# Altium schematic sheet SchLight.SchDoc
size A3; PageSetup: Record=PageOptions|CenterHorizontal=True|CenterVertical=True|PrintScale=0.70|XCorrection=1.00|YCorrection=1.00|PrintKind=0|BorderSize=5000000|LeftOffset=0|BottomOffset=0|Orientation=2|PaperLength=1000|PaperWidth=1000|Scale=100|PaperSource=7|PrintQuality=-4|MediaType=1|DitherType=10|PaperKind=Letter|PrintScaleMode=1
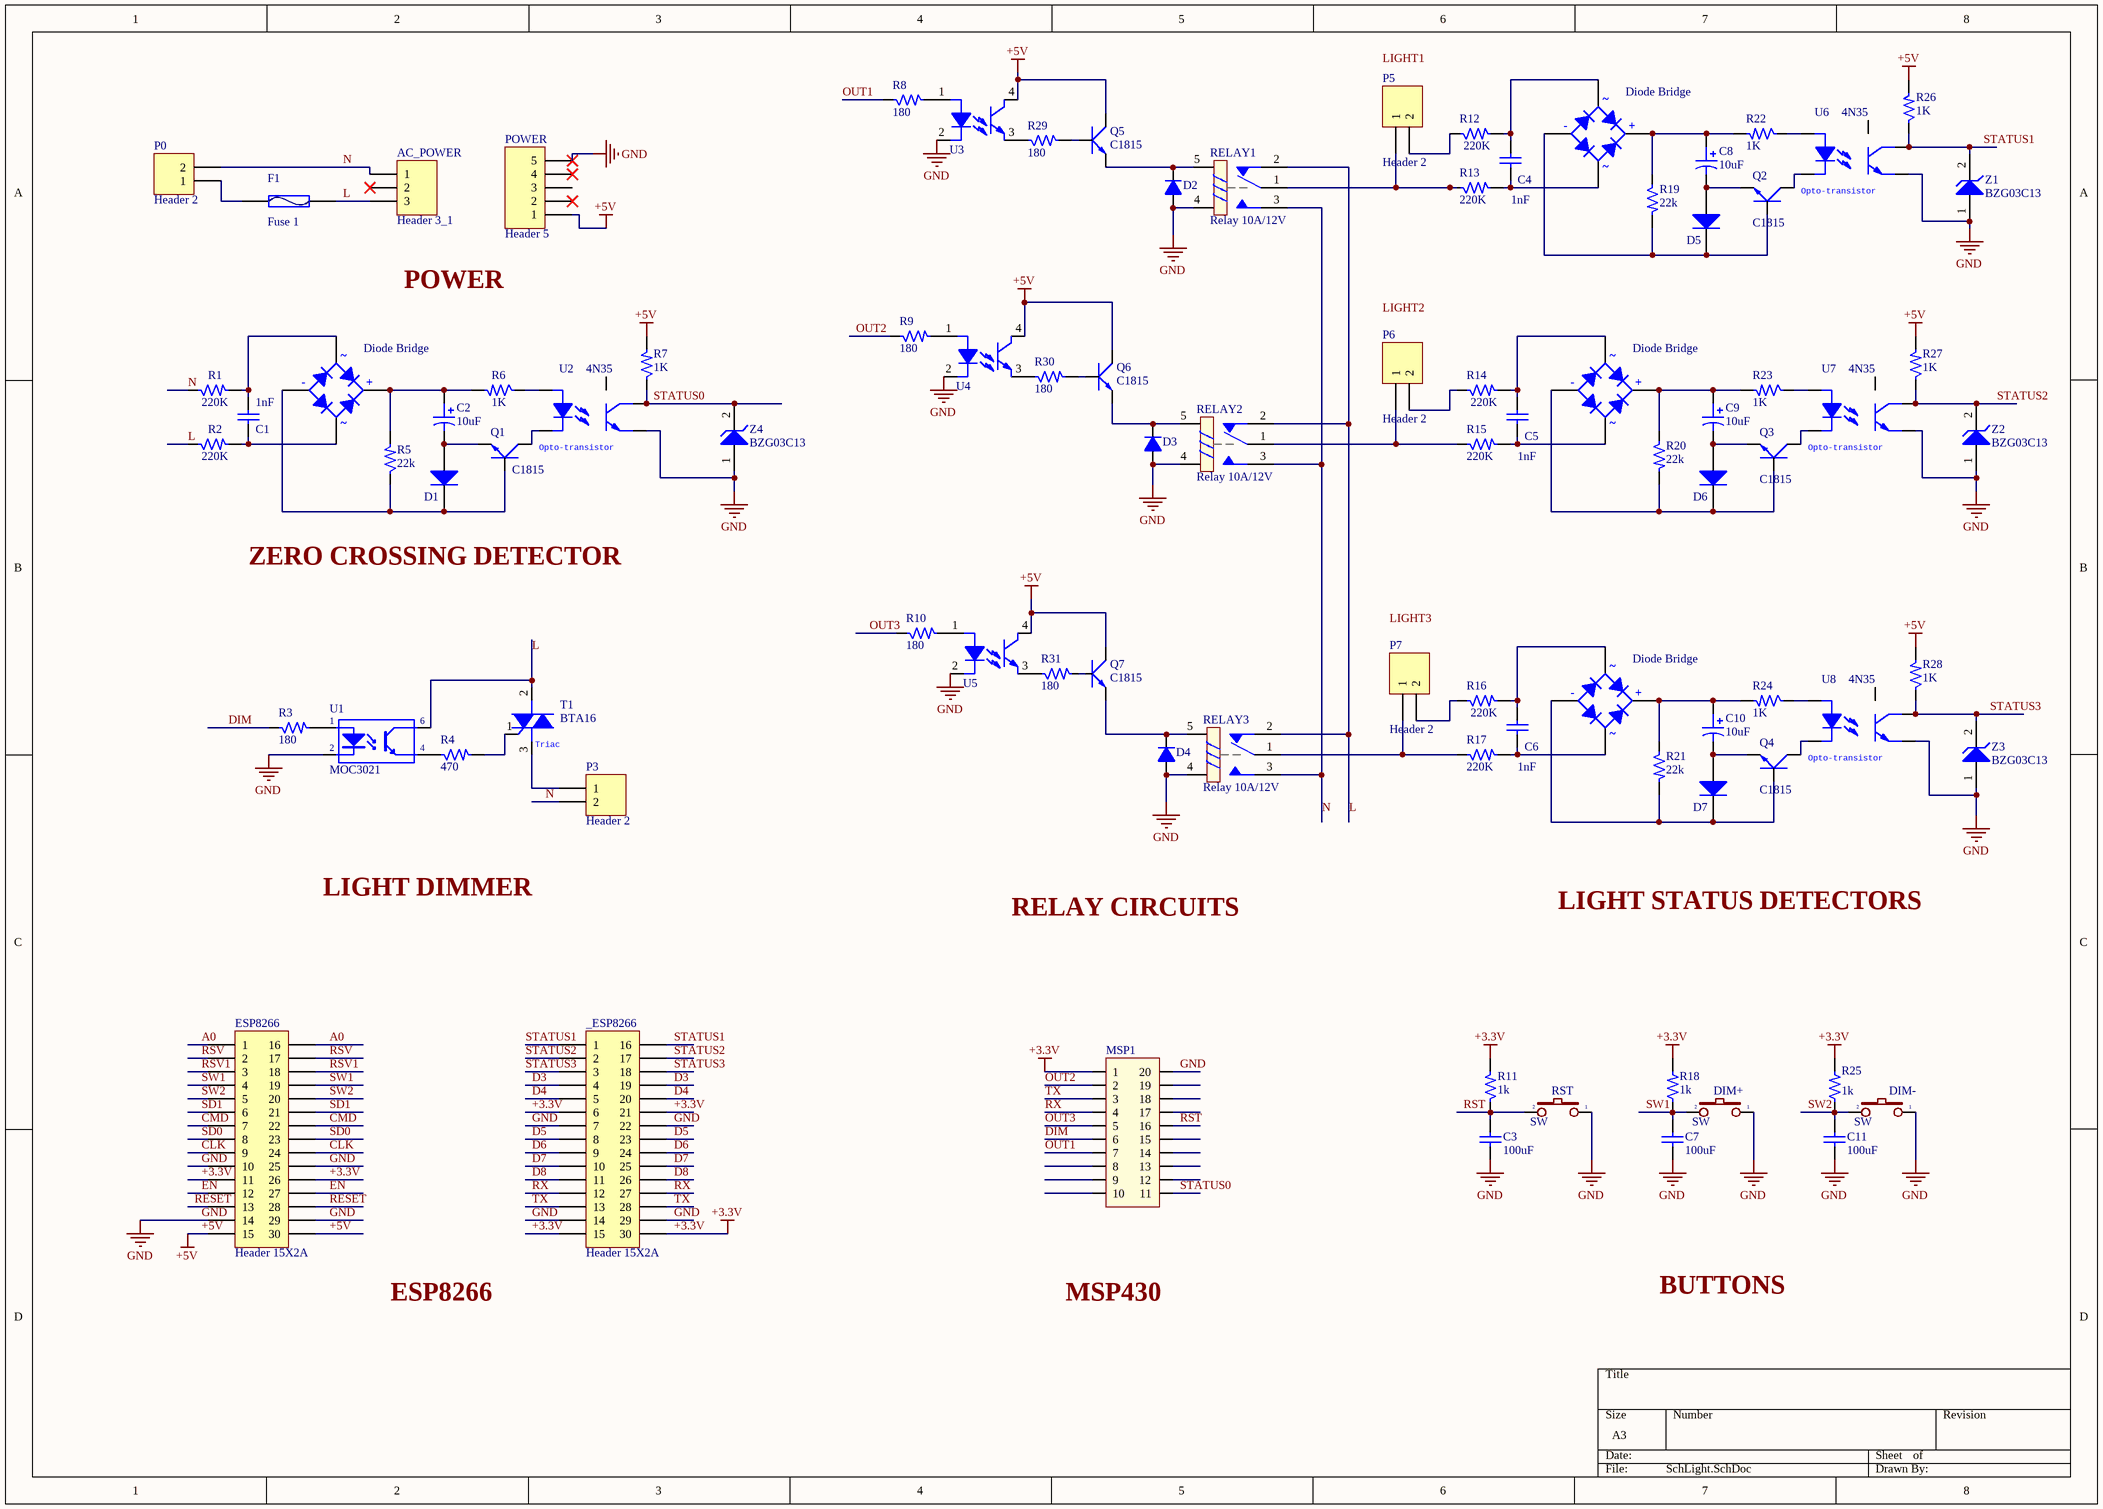
[diagram p0: SchLight.SchDoc]

## Parts
1  Diode Bridge  [DIODE BRIDGE (1A)]
3  Diode Bridge  [DIODE BRIDGE (1A)]
4  Diode Bridge  [DIODE BRIDGE (1A)]
?  Diode Bridge  [DIODE BRIDGE (1A)]
_ESP8266  Header 15X2A  [HDR2X15_CEN]
AC_POWER  Header 3_1  [HDR1X3]
C1  value 1nF  [C-NP-0805]  (hidden comment: Cap Non-pol)
C2  value 10uF  [C-P-0805]  (hidden comment: Cap Pol)
C3  value 100uF  [C-NP-0805]  (hidden comment: Cap Non-pol)
C4  value 1nF  [C-NP-0805]  (hidden comment: Cap Non-pol)
C5  value 1nF  [C-NP-0805]  (hidden comment: Cap Non-pol)
C6  value 1nF  [C-NP-0805]  (hidden comment: Cap Non-pol)
C7  value 100uF  [C-NP-0805]  (hidden comment: Cap Non-pol)
C8  value 10uF  [C-P-0805]  (hidden comment: Cap Pol)
C9  value 10uF  [C-P-0805]  (hidden comment: Cap Pol)
C10  value 10uF  [C-P-0805]  (hidden comment: Cap Pol)
C11  value 100uF  [C-NP-0805]  (hidden comment: Cap Non-pol)
D1  Diode 1N4148  [SOD80]  (value not drawn)
D2  Diode  [SOD80]  (value not drawn)
D3  Diode  [SOD80]  (value not drawn)
D4  Diode  [SOD80]  (value not drawn)
D5  Diode 1N4148  [SOD80]  (value not drawn)
D6  Diode 1N4148  [SOD80]  (value not drawn)
D7  Diode 1N4148  [SOD80]  (value not drawn)
DIM+  SW  [SW4]
DIM-  SW  [SW4]
ESP8266  Header 15X2A  [HDR2X15_CEN]
F1  Fuse 1  [Fuse]
MSP1  Zip 20  [DIP20/W0.3]  (value not drawn)
P0  Header 2  [TBlock 2]
P3  Header 2  [TBlock 2]
P5  Header 2  [TBlock 2]
P6  Header 2  [TBlock 2]
P7  Header 2  [TBlock 2]
POWER  Header 5  [Header 5]
Q1  C1815  [SOT23B]
Q2  C1815  [SOT23B]
Q3  C1815  [SOT23B]
Q4  C1815  [SOT23B]
Q5  C1815  [SOT23B]
Q6  C1815  [SOT23B]
Q7  C1815  [SOT23B]
R1  220K  [SM-1206]
R2  220K  [SM-1206]
R3  180  [SM-1206]
R4  470  [SM-1206]
R5  22k  [SM-1206]
R6  1K  [SM-1206]
R7  1K  [SM-1206]
R8  180  [SM-1206]
R9  180  [SM-1206]
R10  180  [SM-1206]
R11  1k  [SM-1206]
R12  220K  [SM-1206]
R13  220K  [SM-1206]
R14  220K  [SM-1206]
R15  220K  [SM-1206]
R16  220K  [SM-1206]
R17  220K  [SM-1206]
R18  1k  [SM-1206]
R19  22k  [SM-1206]
R20  22k  [SM-1206]
R21  22k  [SM-1206]
R22  1K  [SM-1206]
R23  1K  [SM-1206]
R24  1K  [SM-1206]
R25  1k  [SM-1206]
R26  1K  [SM-1206]
R27  1K  [SM-1206]
R28  1K  [SM-1206]
R29  180  [SM-1206]
R30  180  [SM-1206]
R31  180  [SM-1206]
RELAY1  Relay 10A/12V  [RL_SPDT_10A]
RELAY2  Relay 10A/12V  [RL_SPDT_10A]
RELAY3  Relay 10A/12V  [RL_SPDT_10A]
RST  SW  [SW4]
T1  BTA16  [TO-220]
U1  MOC3021  [DIP6/W0.3]
U2  4N35  [DIP6]
U3  PC817  [DIP4]  (value not drawn)
U4  PC817  [DIP4]  (value not drawn)
U5  PC817  [DIP4]  (value not drawn)
U6  4N35  [DIP6]
U7  4N35  [DIP6]
U8  4N35  [DIP6]
Z1  BZG03C13  [SMD Capacistor 1206]
Z2  BZG03C13  [SMD Capacistor 1206]
Z3  BZG03C13  [SMD Capacistor 1206]
Z4  BZG03C13  [SMD Capacistor 1206]

## Nets
+3.3V: _ESP8266.6 _ESP8266.15 _ESP8266.21 _ESP8266.30 ESP8266.11 ESP8266.26 MSP1.1 R11.2 R18.2 R25.2
+5V: ESP8266.15 ESP8266.30 POWER.1 Q5.2(C) Q6.2(C) Q7.2(C) R7.2 R26.2 R27.2 R28.2 U3.4 U4.4 U5.4
GND: _ESP8266.7 _ESP8266.14 _ESP8266.22 _ESP8266.29 C3.1 C7.1 C11.1 D2.1(A) D3.1(A) D4.1(A) DIM+.1 DIM-.1 ESP8266.10 ESP8266.14 ESP8266.25 ESP8266.29 MSP1.20 POWER.5 RELAY1.4 RELAY2.4 RELAY3.4 RST.1 U1.2(K) U2.4 U3.2 U4.2 U5.2 U6.4 U7.4 U8.4 Z1.1(A) Z2.1(A) Z3.1(A) Z4.1(A)
A0: ESP8266.1 ESP8266.16
CLK: ESP8266.9 ESP8266.24
CMD: ESP8266.7 ESP8266.22
D3: _ESP8266.4 _ESP8266.19
D4: _ESP8266.5 _ESP8266.20
D5: _ESP8266.8 _ESP8266.23
D6: _ESP8266.9 _ESP8266.24
D7: _ESP8266.10 _ESP8266.25
D8: _ESP8266.11 _ESP8266.26
DIM: MSP1.6 R3.1
EN: ESP8266.12 ESP8266.27
L: AC_POWER.3 F1.2 R2.1 RELAY1.2 RELAY2.2 RELAY3.2 T1.2(A1) U1.6(C)
N: AC_POWER.1 P0.2 P3.2 R1.1 RELAY1.3 RELAY2.3 RELAY3.3
OUT1: MSP1.7 R8.1
OUT2: MSP1.2 R9.1
OUT3: MSP1.5 R10.1
RESET: ESP8266.13 ESP8266.28
RST: C3.2 MSP1.16 R11.1 RST.2
RSV: ESP8266.2 ESP8266.17
RSV1: ESP8266.3 ESP8266.18
RX: _ESP8266.12 _ESP8266.27 MSP1.4
SD0: ESP8266.8 ESP8266.23
SD1: ESP8266.6 ESP8266.21
STATUS0: MSP1.11 R7.1 U2.5 Z4.2(K)
STATUS1: _ESP8266.1 _ESP8266.16 R26.1 U6.5 Z1.2(K)
STATUS2: _ESP8266.2 _ESP8266.17 R27.1 U7.5 Z2.2(K)
STATUS3: _ESP8266.3 _ESP8266.18 R28.1 U8.5 Z3.2(K)
SW1: C7.2 DIM+.2 ESP8266.4 ESP8266.19 R18.1
SW2: C11.2 DIM-.2 ESP8266.5 ESP8266.20 R25.1
TX: _ESP8266.13 _ESP8266.28 MSP1.3
Net1_1: 1.1(K) C2.1 R5.2 R6.2
Net1_2: 1.2(C) C1.2 R1.2
Net1_3: 1.3(C) C1.1 R2.2
Net1_4: 1.4(A) D1.2(K) Q1.3(B) R5.1
Net3_1: 3.1(K) C9.1 R20.1 R23.2
Net3_2: 3.2(C) C5.2 R14.2
Net3_3: 3.3(C) C5.1 R15.2
Net3_4: 3.4(A) D6.2(K) Q3.3(B) R20.2
Net4_1: 4.1(K) C10.1 R21.1 R24.2
Net4_2: 4.2(C) C6.2 R16.2
Net4_3: 4.3(C) C6.1 R17.2
Net4_4: 4.4(A) D7.2(K) Q4.3(B) R21.2
Net?_1: ?.1(K) C8.1 R19.1 R22.2
Net?_2: ?.2(C) C4.2 R12.2
Net?_3: ?.3(C) C4.1 R13.2
Net?_4: ?.4(A) D5.2(K) Q2.3(B) R19.2
NetC2_2: C2.2 D1.1(A) Q1.1(E)
NetC8_2: C8.2 D5.1(A) Q2.1(E)
NetC9_2: C9.2 D6.1(A) Q3.1(E)
NetC10_2: C10.2 D7.1(A) Q4.1(E)
NetD2_2: D2.2(K) Q5.1(E) RELAY1.5
NetD3_2: D3.2(K) Q6.1(E) RELAY2.5
NetD4_2: D4.2(K) Q7.1(E) RELAY3.5
NetF1_1: F1.1 P0.1
NetP3_1: P3.1 T1.3(A2)
NetP5_1: P5.1 R13.1 RELAY1.1
NetP5_2: P5.2 R12.1
NetP6_1: P6.1 R15.1 RELAY2.1
NetP6_2: P6.2 R14.1
NetP7_1: P7.1 R17.1 RELAY3.1
NetP7_2: P7.2 R16.1
NetQ1_2: Q1.2(C) U2.2
NetQ2_2: Q2.2(C) U6.2
NetQ3_2: Q3.2(C) U7.2
NetQ4_2: Q4.2(C) U8.2
NetQ5_3: Q5.3(B) R29.2
NetQ6_3: Q6.3(B) R30.2
NetQ7_3: Q7.3(B) R31.2
NetR3_2: R3.2 U1.1(A)
NetR4_1: R4.1 U1.4(E)
NetR4_2: R4.2 T1.1(G)
NetR6_1: R6.1 U2.1
NetR8_2: R8.2 U3.1
NetR9_2: R9.2 U4.1
NetR10_2: R10.2 U5.1
NetR22_1: R22.1 U6.1
NetR23_1: R23.1 U7.1
NetR24_1: R24.1 U8.1
NetR29_1: R29.1 U3.3
NetR30_1: R30.1 U4.3
NetR31_1: R31.1 U5.3

Not connected (* = marked no-connect by the designer): AC_POWER 2*; MSP1 8 9 10 12 13 14 15 17 18 19; POWER 2* 3 4*; U2 6; U6 6; U7 6; U8 6

## Notes on the sheet
- POWER
- ZERO CROSSING DETECTOR
- LIGHT DIMMER
- RELAY CIRCUITS
- LIGHT STATUS DETECTORS
- ESP8266
- MSP430
- BUTTONS
- Labels drawn without touching a wire or pin: LIGHT1, LIGHT2, LIGHT3
- (in symbol 4N35) Opto-transistor
- (in symbol Diode Bridge) ~; -; +

## Library data of the parts
1 3 4 ? = Diode Bridge: Full Wave Diode Bridge; Published: 8-Jun-2000; LatestRevisionDate: 17-Jul-2002; LatestRevisionNote: Re-released for DXP Platform.; PackageReference: D-38; Publisher: Altium Limited
_ESP8266 ESP8266 = Header 15X2A: Header, 15-Pin, Dual row; LatestRevisionDate: 17-Jul-2002; LatestRevisionNote: Re-released for DXP Platform.; Publisher: Altium Limited
AC_POWER = Header 3_1: Header, 3-Pin; LatestRevisionDate: 17-Jul-2002; LatestRevisionNote: Re-released for DXP Platform.; Publisher: Altium Limited
C1 C3-C7 C11 = Cap Non-pol: Non-polarized Capacitor; Published: 8-Jun-2000; LatestRevisionDate: 17-Jul-2002; LatestRevisionNote: Re-released for DXP Platform.; PackageReference: RAD-0.3; Publisher: Altium Limited
C2 C8-C10 = Cap Pol: Polarized Capacitor; Published: 8-Jun-2000; LatestRevisionDate: 17-Jul-2002; LatestRevisionNote: Re-released for DXP Platform.; PackageReference: POLAR0.8; Publisher: Altium Limited
D1 D5-D7 = Diode 1N4148: High Conductance Fast Diode; Published: 8-Jun-2000; LatestRevisionDate: 17-Jul-2002; LatestRevisionNote: Re-released for DXP Platform.; DatasheetVersion: 1997; PackageReference: DO-35; Publisher: Altium Limited; PackageDescription: Diode, Axial; Body 3.8 x 1.9 mm (LxDia. max), Lead Dia. 0.53 mm (max); Code_JEDEC: DO-204-AH; ComponentLink1Description: Manufacturer Link; ComponentLink1URL: http://www.fairchildsemi.com/; ComponentLink2Description: Datasheet; ComponentLink2URL: http://www.fairchildsemi.com/ds/1N%2F1N4148.pdf
D2-D4 = Diode: Vendor: Digikey; Value: FRxxx; Published: 8-Jun-2000; LatestRevisionDate: 17-Jul-2002; LatestRevisionNote: Re-released for DXP Platform.; DatasheetDocument: 1997; PackageReference: DO-35; Publisher: Altium Limited; Code_JEDEC: DO-204-AH; ComponentLink1Description: Digikey Part Link; ComponentLink1URL: http://www.fairchildsemi.com/; ComponentLink2Description: Open Datasheet; ComponentLink2URL: H:\LIBRARY\LIBRARY.Datasheet\ds26003.pdf
DIM+ DIM- RST = SW2: Switch button 2 pin; Value: SW chip 2 pin
F1 = Fuse 1: Fuse; Published: 8-Jun-2000; LatestRevisionDate: 17-Jul-2002; LatestRevisionNote: Re-released for DXP Platform.; PackageReference: PIN-W2/E2.8; Publisher: Altium Limited
MSP1 = Zip20: De 20 pin; Value: Gat 20 pin
P0 P3 P5-P7 = Header 2: Header, 2-Pin; LatestRevisionDate: 17-Jul-2002; LatestRevisionNote: Re-released for DXP Platform.; Publisher: Altium Limited
POWER = Header 5: Header, 5-Pin; LatestRevisionDate: 17-Jul-2002; LatestRevisionNote: Re-released for DXP Platform.; Publisher: Altium Limited
Q1-Q7 = C1815_1: NPN 600mW, ECB; Value: C1815
R1-R31 = R: Resistor 1/4W; Value: R1/4W - 1K
RELAY1-RELAY3 = Relay 1: Relay SPDT,10A - 12VDC 5 Pin; Value: Relay SPDT, 10A, 12V
T1 = BTA16: Triac; ComponentLink2Description: Open Datasheet; ComponentLink2URL: H:\LIBRARY\LIBRARY.Datasheet\
U1 = MOC3021: Single Opto; Value: MOC3021
U2 U6-U8 = 4N35: Opto Couple; Vendor: Digikey; Published: 13-April-2009; Publisher: Hoang Nguyen; ComponentLink1Description: Digikey Part Link; ComponentLink2Description: Open Datasheet; ComponentLink2URL: H:\LIBRARY\LIBRARY.Datasheet\
U3-U5 = PC817: Opto Couple; Vendor: Digikey; Fc: 80Khz; Published: 13-April-2009; Publisher: Hoang Nguyen; ComponentLink1Description: Digikey Part Link; ComponentLink2Description: Open Datasheet; ComponentLink2URL: H:\LIBRARY\LIBRARY.Datasheet\ds_PC817.pdf
Z1-Z4 = BZG03C13: Zener Diode, 6.2V, 5W; Vendor: Digikey; Published: 5-Jan-2004; DatasheetDocument: RevB, 21-Aug-2003; Publisher: Altium Limited; ComponentLink1Description: Digikey Part Link; ComponentLink2Description: Open Datasheet; ComponentLink2URL: H:\LIBRARY\LIBRARY.Datasheet\